# EAGLE schematic robo0 (EAGLE 9.1.1)
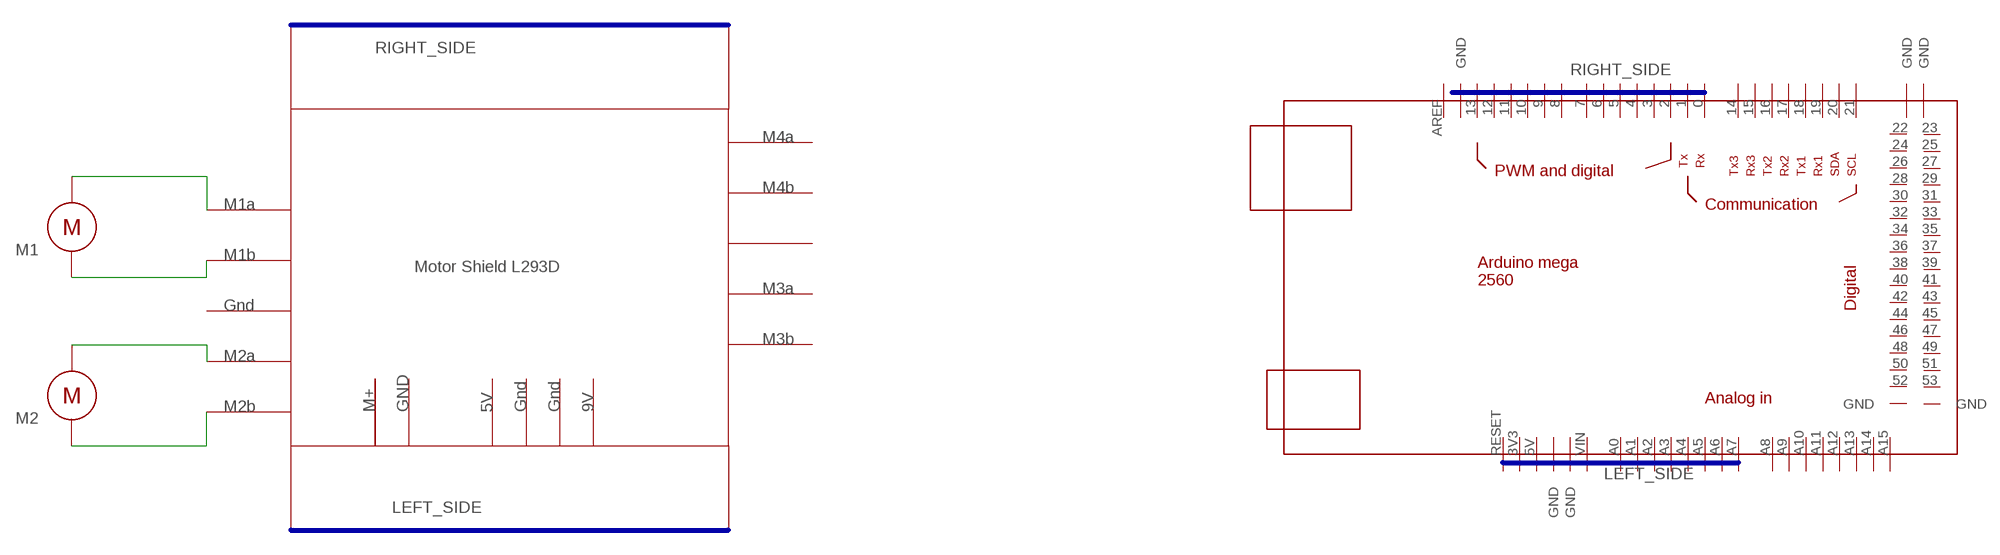
[diagram p0: schematic, sheet 1, part 1 of 2]
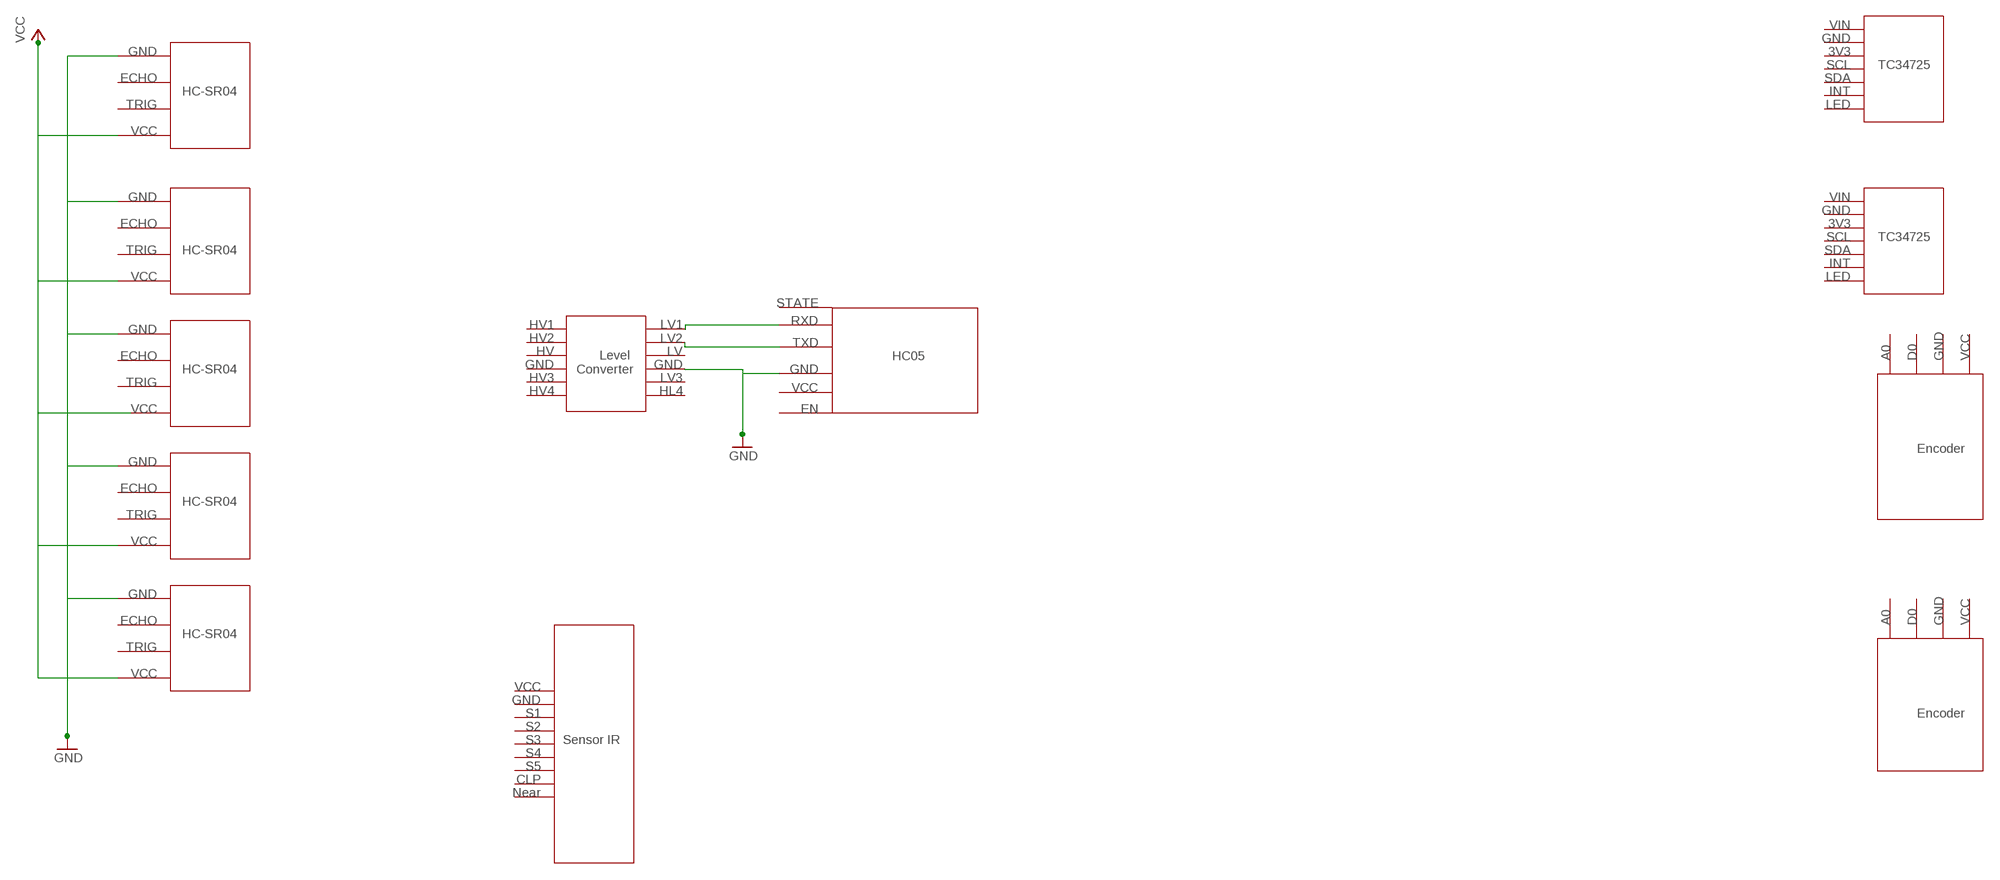
[diagram p1: schematic, sheet 1, part 2 of 2]

## Parts
M1  308-100  [308-100]
M2  308-100  [308-100]
U$1  MEGA_DEVICE  [MEGAOUTLINE]

## Nets
N$1: M1.NEG
N$2: M1.POS
N$3: M2.NEG
N$4: M2.POS
Unconnected: U$1.0 U$1.1 U$1.2 U$1.3 U$1.3V3 U$1.4 U$1.5 U$1.5V U$1.6 U$1.7 U$1.8 U$1.9 U$1.10 U$1.11 U$1.12 U$1.13 U$1.14 U$1.15 U$1.16 U$1.17 U$1.18 U$1.19 U$1.20 U$1.21 U$1.22 U$1.23 U$1.24 U$1.25 U$1.26 U$1.27 U$1.28 U$1.29 U$1.30 U$1.31 U$1.32 U$1.33 U$1.34 U$1.35 U$1.36 U$1.37 U$1.38 U$1.39 U$1.40 U$1.41 U$1.42 U$1.43 U$1.44 U$1.45 U$1.46 U$1.47 U$1.48 U$1.49 U$1.50 U$1.51 U$1.52 U$1.53 U$1.A0 U$1.A1 U$1.A2 U$1.A3 U$1.A4 U$1.A5 U$1.A6 U$1.A7 U$1.A8 U$1.A9 U$1.A10 U$1.A11 U$1.A12 U$1.A13 U$1.A14 U$1.A15 U$1.AREF U$1.GND@1(GND) U$1.GND@2(GND) U$1.GND@3(GND) U$1.GND@4(GND) U$1.GND@5(GND) U$1.GND@6(GND) U$1.GND@7(GND) U$1.RESET U$1.VIN

## Buses
LEFT_SIDE
RIGHT_SIDE

## Notes on the sheet
- VIN
- GND
- GND | 3V3
- SCL | TC34725
- ECHO | SDA
- HC-SR04 | INT
- TRIG | LED
- VCC
- M4a | GND | VIN
- GND
- ECHO | 3V3
- M4b | SCL | TC34725
- M1a | TRIG | HC-SR04 | SDA
- INT
- VCC | LED
- M1b | Motor Shield L293D
- STATE
- M3a
- RXD
- HV1 | LV1
- Gnd | GND
- HV2 | LV2
- TXD
- HV | LV
- M3b | ECHO | HC05 | A0 | D0 | GND | VCC
- GND | GND
- M2a | HC-SR04
- Level 
  Converter
- GND
- HV3 | LV3
- TRIG
- HV4 | HL4 | VCC
- M2b | M+ | GND | 5V | Gnd | Gnd | 9V | VCC | EN
- Encoder
- GND
- ECHO
- HC-SR04
- TRIG
- VCC
- GND
- ECHO | A0 | D0 | GND | VCC
- HC-SR04
- TRIG
- VCC
- VCC
- GND
- S1 | Encoder
- S2
- S3 | Sensor IR
- S4
- S5
- CLP
- Near

## Library data of the parts
M1 M2 = motor:308-100: Pico Vibe 8mm Vibration Motor - 3mm Type; PRECISION_MICRODRIVES: 308-100
U$1 = ArduinoMegaOutline:MEGA_DEVICE: mega card as device